# EAGLE schematic cos - POC (EAGLE 9.4.0)
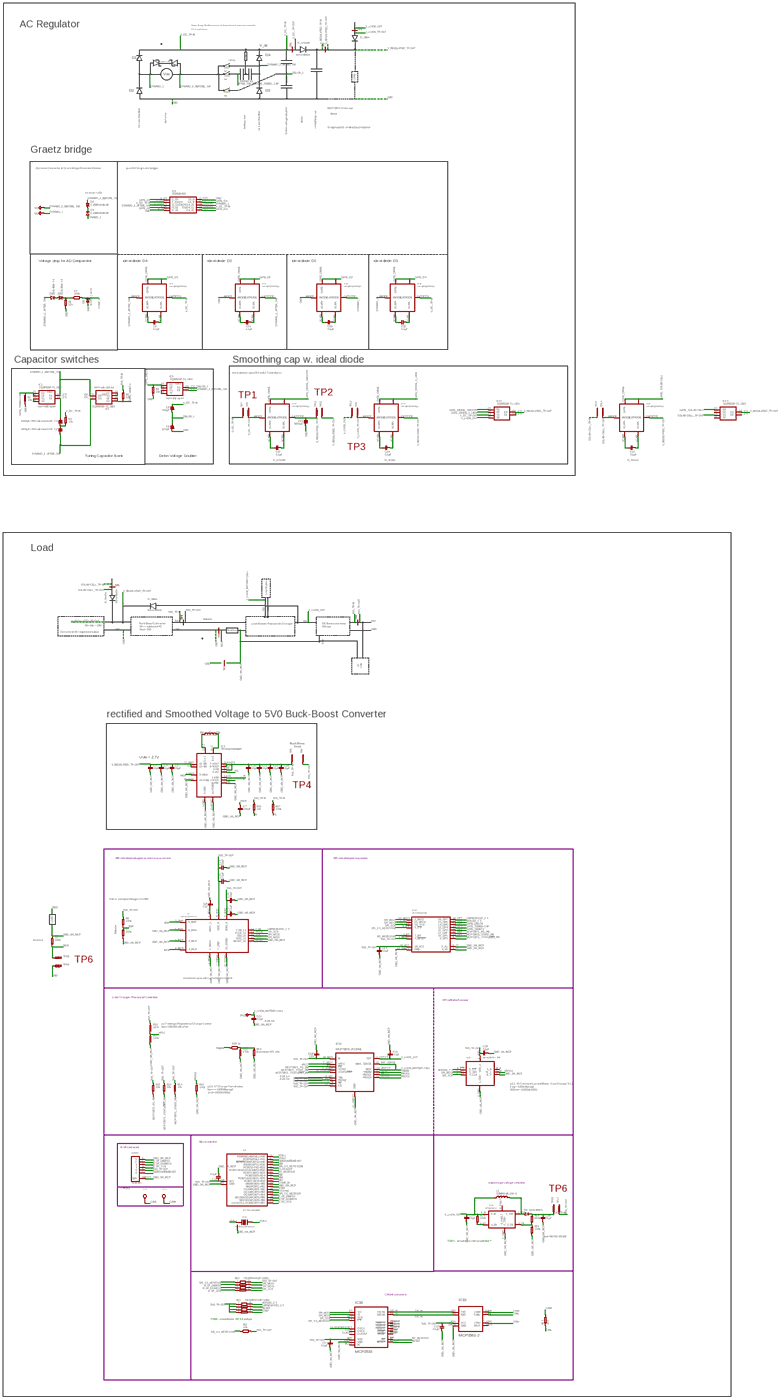
[diagram p0: schematic, sheet 1, overview]
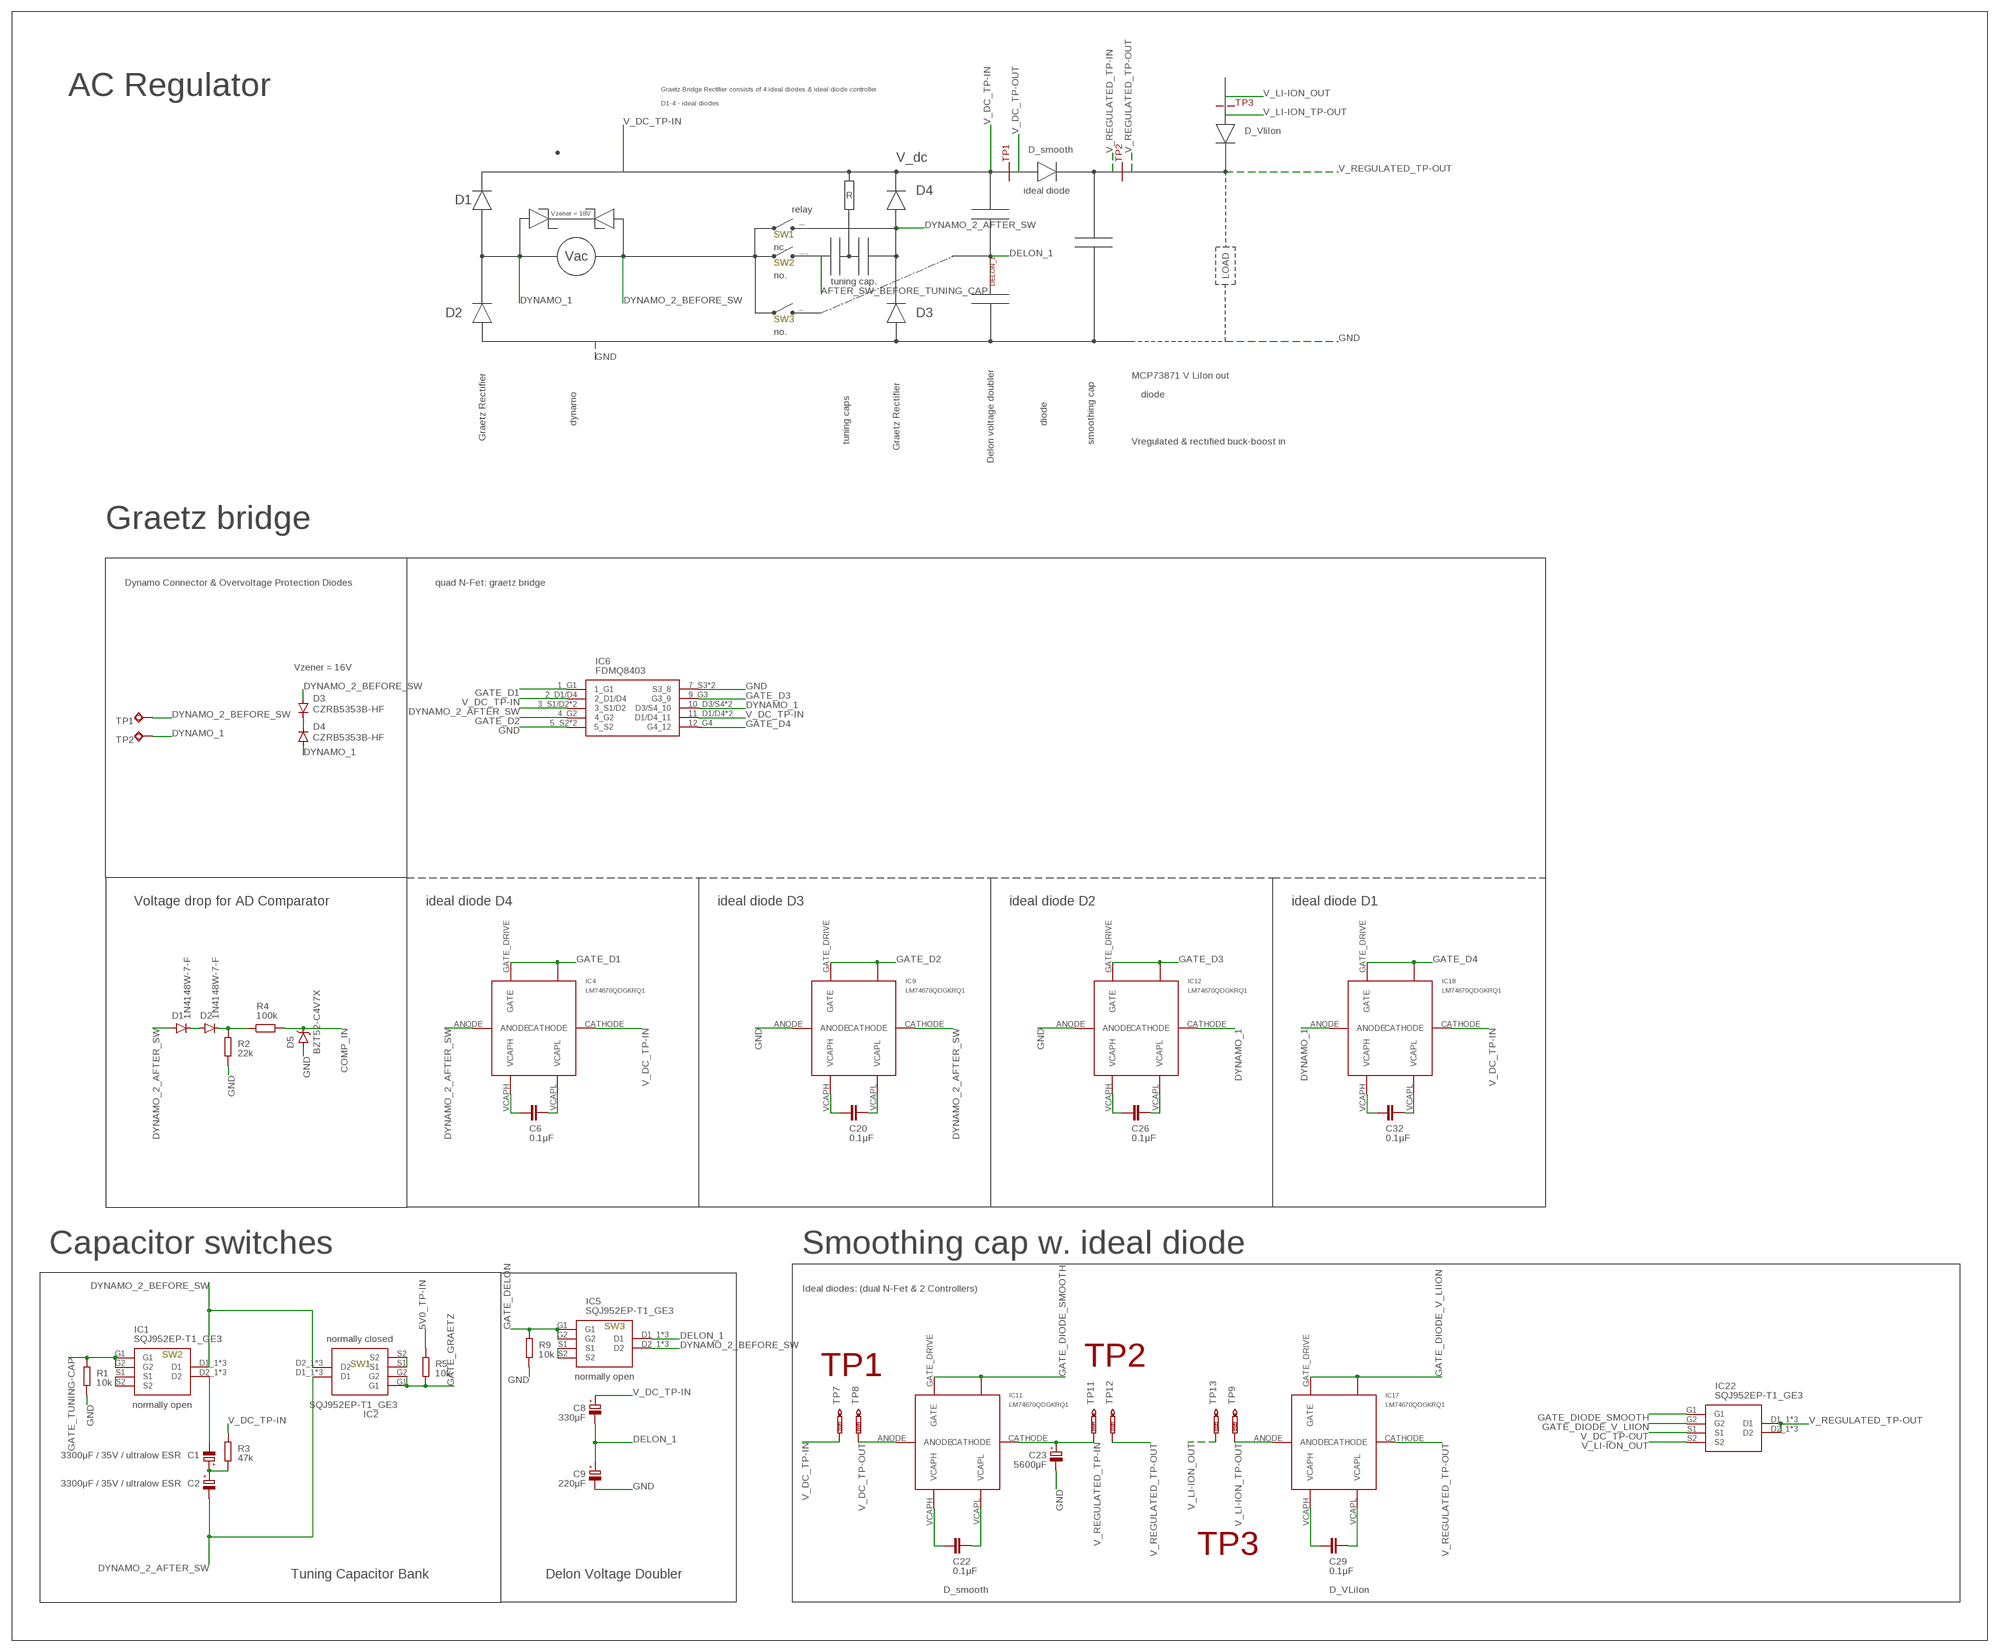
[diagram p1: schematic, sheet 1, part 1 of 5]
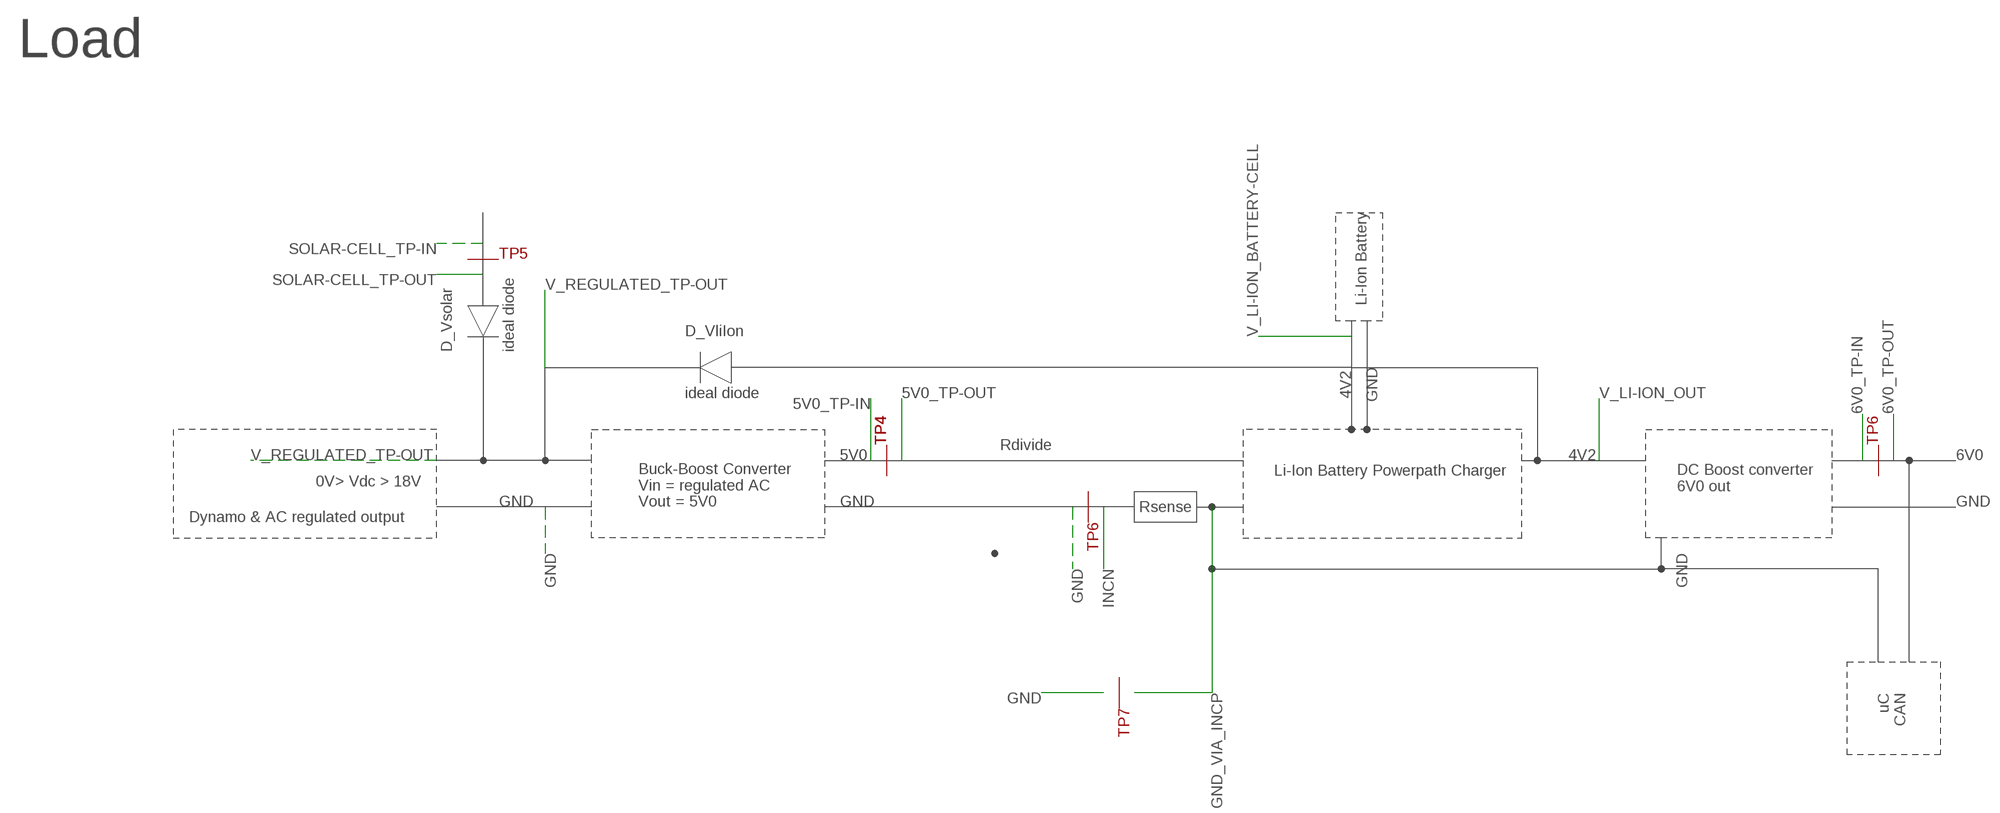
[diagram p2: schematic, sheet 1, part 2 of 5]
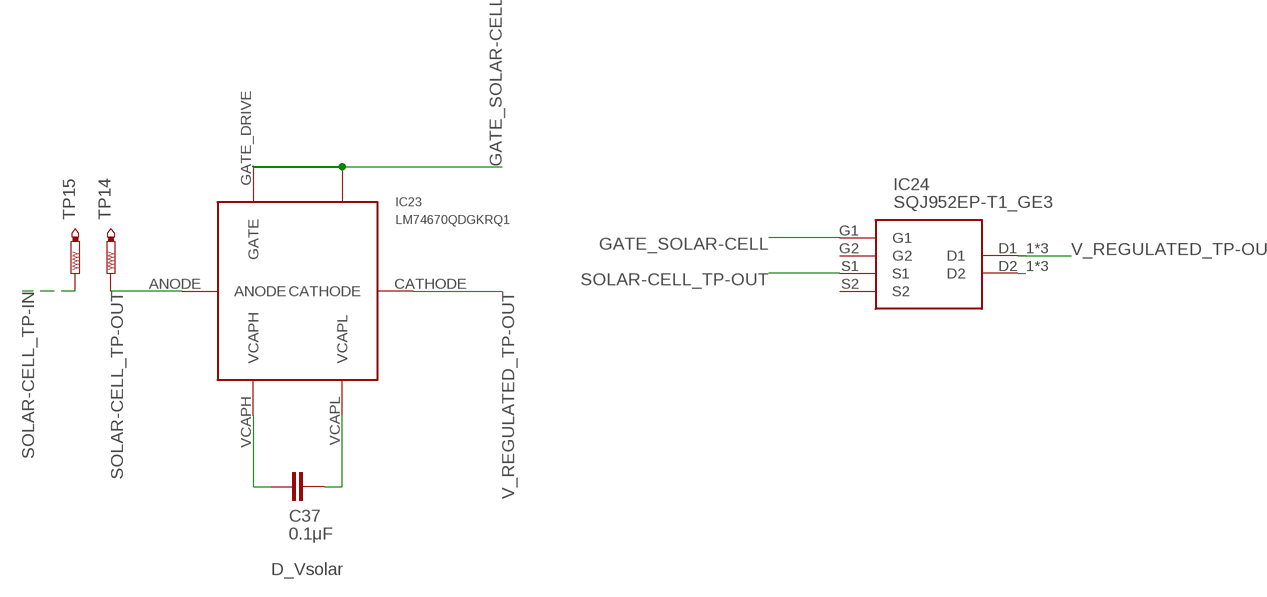
[diagram p3: schematic, sheet 1, part 3 of 5]
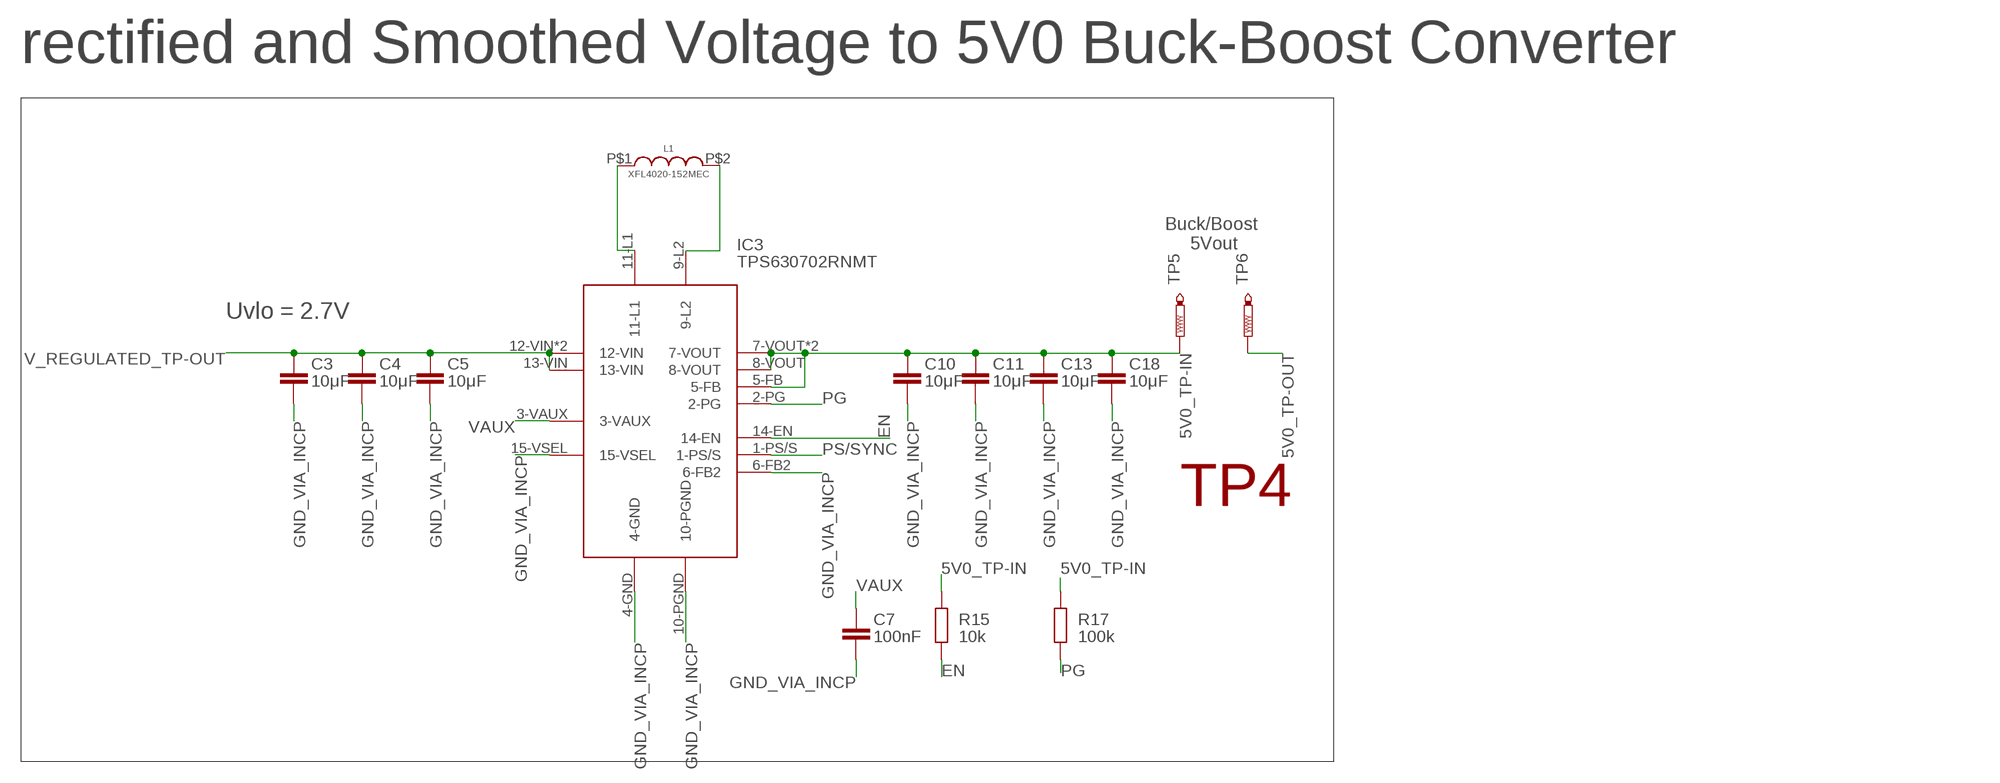
[diagram p4: schematic, sheet 1, part 4 of 5]
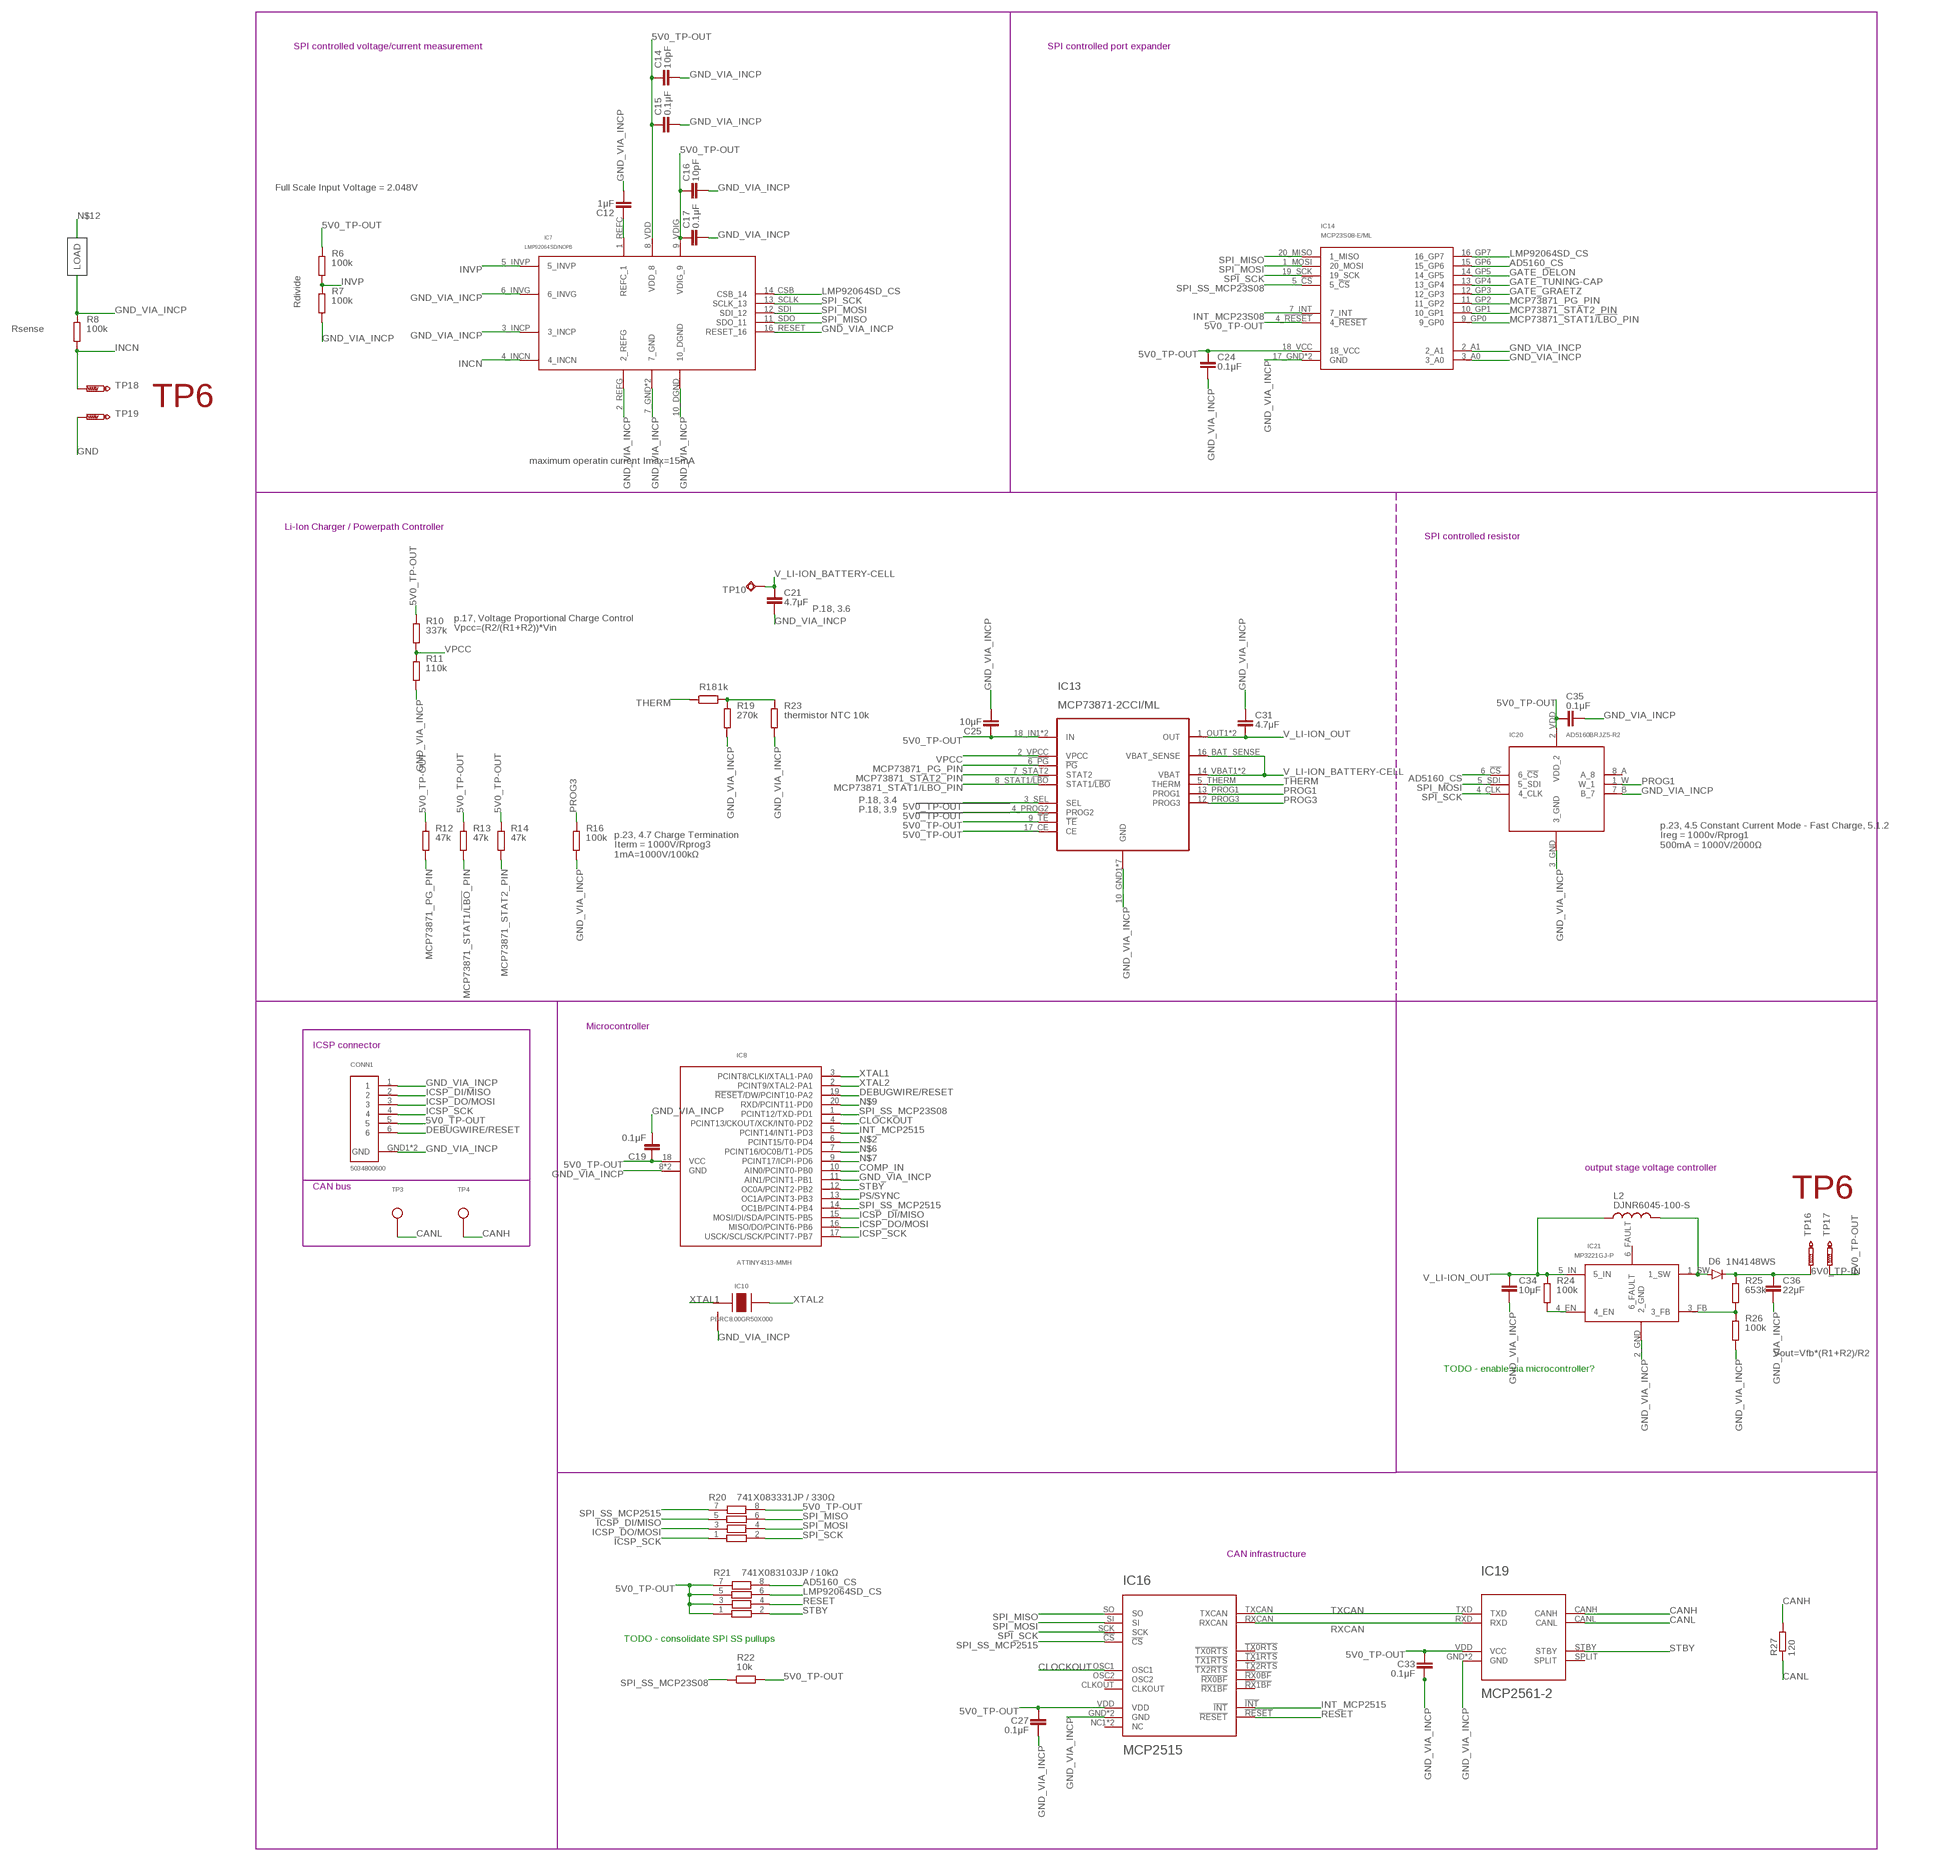
[diagram p5: schematic, sheet 1, part 5 of 5]

## Parts
C1  3300μF / 35V / ultralow ESR  CPOL-EUE1.8-4  [E1,8-4]
C2  3300μF / 35V / ultralow ESR  CPOL-EUE1.8-4  [E1,8-4]
C3  10μF  C-EUC0805  [C0805]
C4  10μF  C-EUC0805  [C0805]
C5  10μF  C-EUC0603  [C0603]
C6  0.1μF  C-EUC0402  [C0402]
C7  100nF  C-EUC0402  [C0402]
C8  330μF  CPOL-EUE1.8-4  [E1,8-4]
C9  220μF  CPOL-EUE1.8-4  [E1,8-4]
C10  10μF  C-EUC0603  [C0603]
C11  10μF  C-EUC0805  [C0805]
C12  1μF  C-EUC0402  [C0402]
C13  10μF  C-EUC0805  [C0805]
C14  10pF  C-EUC0402  [C0402]
C15  0.1μF  C-EUC0402  [C0402]
C16  10pF  C-EUC0402  [C0402]
C17  0.1μF  C-EUC0402  [C0402]
C18  10μF  C-EUC0805  [C0805]
C19  0.1μF  C-EUC0402  [C0402]
C20  0.1μF  C-EUC0402  [C0402]
C21  4.7μF  C-EUC0402  [C0402]
C22  0.1μF  C-EUC0402  [C0402]
C23  5600μF  CPOL-EUE1.8-4  [E1,8-4]
C24  0.1μF  C-EUC0402  [C0402]
C25  10μF  C-EUC0402  [C0402]
C26  0.1μF  C-EUC0402  [C0402]
C27  0.1μF  C-EUC0402  [C0402]
C29  0.1μF  C-EUC0402  [C0402]
C31  4.7μF  C-EUC0402  [C0402]
C32  0.1μF  C-EUC0402  [C0402]
C33  0.1μF  C-EUC0402  [C0402]
C34  10μF  C-EUC0402  [C0402]
C35  0.1μF  C-EUC0402  [C0402]
C36  22μF  C-EUC0402  [C0402]
C37  0.1μF  C-EUC0402  [C0402]
CONN1  5034800600  [SMT]
D1  1N4148W-7-F  CGRM4006-G  [SOD-123_MINI-SMA]
D2  1N4148W-7-F  CGRM4006-G  [SOD-123_MINI-SMA]
D3  CZRB5353B-HF  DIODE-DO214AA  [DO214AA]
D4  CZRB5353B-HF  DIODE-DO214AA  [DO214AA]
D5  BZT52-C4V7X  CESD5V0D1  [SOD-123]
D6  1N4148WS  [SOD-323]
IC1  SQJ952EP-T1_GE3  [SO-8L]
IC2  SQJ952EP-T1_GE3  [SO-8L]
IC3  TPS630702RNMT  TPS630701  [VQFN]
IC4  LM74670QDGKRQ1  LM74670  [VSSOP-8]
IC5  SQJ952EP-T1_GE3  [SO-8L]
IC6  FDMQ8403  [MLP-12]
IC7  LMP92064SD/NOPB  LMP92064SD  [WSON-16]
IC8  ATTINY4313-MMH  ATTINY4313VQFN-20  [VQFN-20]
IC9  LM74670QDGKRQ1  LM74670  [VSSOP-8]
IC10  PBRC8.00GR50X000  PRQV  [SMT]
IC11  LM74670QDGKRQ1  LM74670  [VSSOP-8]
IC12  LM74670QDGKRQ1  LM74670  [VSSOP-8]
IC13  MCP73871-2CCI/ML  MCP73871-2AAI/ML  [QFN50P400X400X100-21N]
IC14  MCP23S08-E/ML  MCP23S08  [QFN20]
IC16  MCP2515  MCP2515-I-ML  [QFN20]
IC17  LM74670QDGKRQ1  LM74670  [VSSOP-8]
IC18  LM74670QDGKRQ1  LM74670  [VSSOP-8]
IC19  MCP2561-2  [DFN10]
IC20  AD5160BRJZ5-R2  AD5160  [SOT-23-8]
IC21  MP3221GJ-P  MP3221  [TSOT23-6]
IC22  SQJ952EP-T1_GE3  [SO-8L]
IC23  LM74670QDGKRQ1  LM74670  [VSSOP-8]
IC24  SQJ952EP-T1_GE3  [SO-8L]
L1  XFL4020-152MEC  [SMD]
L2  DJNR6045-100-S  [DJNR6045-100-S]
R1  10k  R-EU_R0402  [R0402]
R2  22k  R-EU_R0402  [R0402]
R3  47k  R-EU_R0402  [R0402]
R4  100k  R-EU_R0402  [R0402]
R5  10k  R-EU_R0402  [R0402]
R6  100k  R-EU_R1206  [R1206]
R7  100k  R-EU_R1206  [R1206]
R8  100k  R-EU_R1206  [R1206]
R9  10k  R-EU_R0402  [R0402]
R10  337k  R-EU_R0402  [R0402]
R11  110k  R-EU_R0402  [R0402]
R12  47k  R-EU_R0402  [R0402]
R13  47k  R-EU_R0402  [R0402]
R14  47k  R-EU_R0402  [R0402]
R15  10k  R-EU_R0402  [R0402]
R16  100k  R-EU_R0402  [R0402]
R17  100k  R-EU_R0402  [R0402]
R18  1k  R-EU_R0402  [R0402]
R19  270k  R-EU_R0402  [R0402]
R20  741X083331JP / 330Ω  741X083331JP  [0402]
R21  741X083103JP / 10kΩ  741X083331JP  [0402]
R22  10k  R-EU_R0402  [R0402]
R23  thermistor NTC 10k  R-EU_V526-0  [V526-0]
R24  100k  R-EU_R0402  [R0402]
R25  653k  R-EU_R0402  [R0402]
R26  100k  R-EU_R0402  [R0402]
R27  120  R-EU_R0402  [R0402]
TP1  Li-Ion Cell +  TPSQPAD1-13  [P1-13]
TP2  Li-Ion Cell +  TPSQPAD1-13  [P1-13]
TP3  CAN Low  TP  [TH]
TP4  CAN High  TP  [TH]
TP5  PTR1TP10SQ  [TP10SQ]
TP6  PTR1TP10SQ  [TP10SQ]
TP7  PTR1TP10SQ  [TP10SQ]
TP8  PTR1TP10SQ  [TP10SQ]
TP9  PTR1TP10SQ  [TP10SQ]
TP10  Li-Ion Cell +  TPSQPAD1-13  [P1-13]
TP11  PTR1TP10SQ  [TP10SQ]
TP12  PTR1TP10SQ  [TP10SQ]
TP13  PTR1TP10SQ  [TP10SQ]
TP14  PTR1TP10SQ  [TP10SQ]
TP15  PTR1TP10SQ  [TP10SQ]
TP16  PTR1TP10SQ  [TP10SQ]
TP17  PTR1TP10SQ  [TP10SQ]
TP18  PTR1TP10SQ  [TP10SQ]
TP19  PTR1TP10SQ  [TP10SQ]

## Nets
5V0_TP-IN [5v0]: C10.1 C11.1 C13.1 C18.1 IC3.5-FB IC3.7-VOUT IC3.8-VOUT IC3.VOUT(7-VOUT) R5.2 R15.2 R17.2 TP5.TP
5V0_TP-OUT [5v0]: C14.1 C15.1 C16.1 C17.1 C19.1 C24.1 C25.1 C27.1 C33.1 C35.1 CONN1.5 IC7.8_VDD(VDD_8) IC7.9_VDIG(VDIG_9) IC8.18(VCC) IC13.3_SEL(SEL) IC13.4_PROG2(PROG2) IC13.9_!TE!(!TE!) IC13.17_CE(CE) IC13.18_IN1(IN) IC13.19_IN2(IN) IC14.4_!RESET! IC14.18_VCC IC16.VDD IC19.VDD(VCC) IC20.2_VDD(VDD_2) R6.2 R10.2 R12.2 R13.2 R14.2 R20.8 R21.1 R21.3 R21.5 R21.7 R22.2 TP6.TP
6V0_TP-IN: C36.1 D6.C R25.2 TP16.TP
6V0_TP-OUT: TP17.TP
AD5160_CS: IC14.15_GP6 IC20.6_!CS! R21.8
AFTER_SW_BEFORE_TUNING_CAP: C1.- IC1.D2_1(D2) IC1.D2_2(D2) IC1.D2_3(D2)
CANH [5v0]: IC19.CANH R27.2 TP4.TP$1
CANL [5v0]: IC19.CANL R27.1 TP3.TP$1
CLOCKOUT [signal]: IC8.4(PCINT13/CKOUT/XCK/INT0-PD2) IC16.OSC1
COMP_IN: D5.C IC8.10(AIN0/PCINT0-PB0) R4.2
D1_VCAPH: C6.2 IC4.VCAPH
D1_VCAPL: C6.1 IC4.VCAPL
D2_VCAPH: C20.2 IC9.VCAPH
D2_VCAPL: C20.1 IC9.VCAPL
D3_VCAPH: C26.2 IC12.VCAPH
D3_VCAPL: C26.1 IC12.VCAPL
D4_VCAPH: C32.2 IC18.VCAPH
D4_VCAPL: C32.1 IC18.VCAPL
D_SMOOTH_VCAP: C22.1 IC11.VCAPL
D_SMOOTH_VCAPH: C22.2 IC11.VCAPH
D_VLIION_VCAPH: C29.2 IC17.VCAPH
D_VLIION_VCAPH1: C37.2 IC23.VCAPH
D_VLIION_VCAPL: C29.1 IC17.VCAPL
D_VLIION_VCAPL1: C37.1 IC23.VCAPL
DEBUGWIRE/RESET [signal]: CONN1.6 IC8.19(!RESET!/DW/PCINT10-PA2)
DELON_1: C8.- C9.+ IC5.D1_1(D1) IC5.D1_2(D1) IC5.D1_3(D1)
DYNAMO_1 [dynamo_out]: D4.A IC6.10_D3/S4(D3/S4_10) IC6.D3/S4(D3/S4_10) IC12.CATHODE IC18.ANODE TP2.TP
DYNAMO_2_AFTER_SW: C2.- D1.A IC2.D1_1(D1) IC2.D1_2(D1) IC2.D1_3(D1) IC4.ANODE IC6.3_S1/D2 IC6.S1/D2(3_S1/D2) IC9.CATHODE
DYNAMO_2_BEFORE_SW: D3.A IC1.D1_1(D1) IC1.D1_2(D1) IC1.D1_3(D1) IC2.D2_1(D2) IC2.D2_2(D2) IC2.D2_3(D2) IC5.D2_1(D2) IC5.D2_2(D2) IC5.D2_3(D2) TP1.TP
EN: IC3.14-EN R15.1
EN2: IC21.4_EN R24.1
FB: IC21.3_FB R25.1 R26.2
GATE_D1: IC4.GATE_DRIVE(GATE) IC4.GATE_PULLD IC6.1_G1
GATE_D2: IC6.4_G2 IC9.GATE_DRIVE(GATE) IC9.GATE_PULLD
GATE_D3: IC6.9_G3(G3_9) IC12.GATE_DRIVE(GATE) IC12.GATE_PULLD
GATE_D4: IC6.12_G4(G4_12) IC18.GATE_DRIVE(GATE) IC18.GATE_PULLD
GATE_DELON: IC5.G1 IC5.G2 IC14.14_GP5 R9.2
GATE_DIODE_SMOOTH: IC11.GATE_DRIVE(GATE) IC11.GATE_PULLD IC22.G1
GATE_DIODE_V_LIION: IC17.GATE_DRIVE(GATE) IC17.GATE_PULLD IC22.G2
GATE_GRAETZ: IC2.G1 IC2.G2 IC14.12_GP3 R5.1
GATE_SOLAR-CELL: IC23.GATE_DRIVE(GATE) IC23.GATE_PULLD IC24.G1
GATE_TUNING-CAP: IC1.G1 IC1.G2 IC14.13_GP4 R1.2
GND: C9.- C23.- D5.A IC6.5_S2 IC6.6_S2(5_S2) IC6.7_S3(S3_8) IC6.8_S3(S3_8) IC9.ANODE IC12.ANODE R1.1 R2.1 R9.1 TP19.TP
GND_VIA_INCP: C3.2 C4.2 C5.2 C7.2 C10.2 C11.2 C12.2 C13.2 C14.2 C15.2 C16.2 C17.2 C18.2 C19.2 C21.2 C24.2 C25.2 C27.2 C31.1 C33.2 C34.2 C35.2 C36.2 CONN1.1 CONN1.GND1(GND) CONN1.GND2(GND) IC3.4-GND IC3.6-FB2 IC3.10-PGND IC3.15-VSEL IC7.2_REFG IC7.3_INCP IC7.6_INVG IC7.7_GND IC7.10_DGND IC7.16_RESET(RESET_16) IC7.GND1(7_GND) IC8.8(GND) IC8.11(AIN1/PCINT1-PB1) IC8.GND IC10.GND IC13.10_GND1(GND) IC13.11_GND2(GND) IC13.GND2(GND) IC13.GND3(GND) IC13.GND4(GND) IC13.GND5(GND) IC13.GND6(GND) IC14.2_A1 IC14.3_A0 IC14.17_GND(GND) IC14.GND IC16.GND IC16.GND6(GND) IC19.GND IC19.VSS(GND) IC20.3_GND IC20.7_B(B_7) IC21.2_GND R7.1 R8.2 R11.1 R16.1 R19.1 R23.1 R26.1
ICSP_DI/MISO [signal]: CONN1.2 IC8.15(MOSI/DI/SDA/PCINT5-PB5) R20.5
ICSP_DO/MOSI [signal]: CONN1.3 IC8.16(MISO/DO/PCINT6-PB6) R20.3
ICSP_SCK [signal]: CONN1.4 IC8.17(USCK/SCL/SCK/PCINT7-PB7) R20.1
INCN: IC7.4_INCN R8.1 TP18.TP
INT_MCP23S08: IC14.7_INT
INT_MCP2515 [signal]: IC8.5(PCINT14/INT1-PD3) IC16.!INT!
INVP: IC7.5_INVP R6.1 R7.2
LMP92064SD_CS: IC7.14_CSB(CSB_14) IC14.16_GP7 R21.6
MCP73871_PG_PIN [signal]: IC13.!6_PG!(!PG!) IC14.11_GP2 R12.1
MCP73871_STAT1/!LBO!_PIN [signal]: IC13.8_STAT1/!LBO!(STAT1/!LBO!) IC14.9_GP0 R13.1
MCP73871_STAT2_PIN [signal]: IC13.7_STAT2(STAT2) IC14.10_GP1 R14.1
N$1: IC3.11-L1 L1.P$1
N$2: IC8.6(PCINT15/T0-PD4)
N$3: D1.C D2.A
N$4: D2.C R2.2 R4.1
N$5: IC3.9-L2 L1.P$2
N$6: IC8.7(PCINT16/OC0B/T1-PD5)
N$7: IC8.9(PCINT17/ICPI-PD6)
N$8: R18.2 R19.2 R23.2
N$9: IC8.20(RXD/PCINT11-PD0)
N$13: IC1.S1 IC1.S2
N$16: IC2.S1 IC2.S2
N$17: C12.1 IC7.1_REFC(REFC_1)
N$20: IC5.S1 IC5.S2
PG [signal]: IC3.2-PG R17.1
PROG1 [signal]: IC13.13_PROG1(PROG1) IC20.1_W(W_1)
PROG3 [signal]: IC13.12_PROG3(PROG3) R16.2
PS/SYNC [signal]: IC3.1-PS/S IC8.13(OC1A/PCINT3-PB3)
RESET [signal]: IC16.!RESET! R21.4
RXCAN [signal]: IC16.RXCAN IC19.RXD
SOLAR-CELL_TP-IN: TP15.TP
SOLAR-CELL_TP-OUT: IC23.ANODE IC24.S1 TP14.TP
SPI_MISO [signal]: IC7.11_SDO(SDO_11) IC14.20_MISO(1_MISO) IC16.SO R20.6
SPI_MOSI [signal]: IC7.12_SDI(SDI_12) IC14.1_MOSI(20_MOSI) IC16.SI IC20.5_SDI R20.4
SPI_SCK: IC7.13_SCLK(SCLK_13) IC14.19_SCK IC16.SCK IC20.4_CLK R20.2
SPI_SS_MCP23S08: IC8.1(PCINT12/TXD-PD1) IC14.5_!CS! R22.1
SPI_SS_MCP2515 [signal]: IC8.14(OC1B/PCINT4-PB4) IC16.!CS! R20.7
STBY [signal]: IC8.12(OC0A/PCINT2-PB2) IC19.STBY R21.2
SW: D6.A IC21.1_SW L2.2
THERM: IC13.5_THERM(THERM) R18.1
TUNIN_CAP2_BIAS: C1.+ C2.+ R3.1
TXCAN [signal]: IC16.TXCAN IC19.TXD
V_DC_TP-IN: C8.+ IC4.CATHODE IC6.2_D1/D4 IC6.11_D1/D4(D1/D4_11) IC6.D1/D4(D1/D4_11) IC18.CATHODE R3.2 TP7.TP
V_DC_TP-OUT: IC11.ANODE IC22.S1 TP8.TP
V_LI-ION_BATTERY-CELL: C21.1 IC13.14_VBAT1(VBAT) IC13.15_VBAT2(VBAT) IC13.16_BAT_SENSE(VBAT_SENSE) TP10.TP
V_LI-ION_OUT: C31.2 C34.1 IC13.1_OUT1(OUT) IC13.20_OUT2(OUT) IC21.5_IN IC22.S2 L2.1 R24.2 TP13.TP
V_LI-ION_TP-OUT: IC17.ANODE TP9.TP
V_REGULATED_TP-IN [5v0]: C23.+ IC11.CATHODE TP11.TP
V_REGULATED_TP-OUT [5v0]: C3.1 C4.1 C5.1 IC3.12-VIN IC3.13-VIN IC3.VIN(12-VIN) IC17.CATHODE IC22.D1_1(D1) IC22.D1_2(D1) IC22.D1_3(D1) IC22.D2_1(D2) IC22.D2_2(D2) IC22.D2_3(D2) IC23.CATHODE IC24.D1_1(D1) IC24.D1_2(D1) IC24.D1_3(D1) TP12.TP
VAUX: C7.1 IC3.3-VAUX
VPCC: IC13.2_VPCC(VPCC) R10.1 R11.2
XTAL1 [signal]: IC8.3(PCINT8/CLKI/XTAL1-PA0) IC10.XTAL1
XTAL2 [signal]: IC8.2(PCINT9/XTAL2-PA1) IC10.XTAL2
ZENER_COMMON: D3.C D4.C
Unconnected: IC16.!RX0BF! IC16.!RX1BF! IC16.!TX0RTS! IC16.!TX1RTS! IC16.!TX2RTS! IC16.CLKOUT IC16.NC1(NC) IC16.NC2(NC) IC16.OSC2 IC19.SPLIT IC20.8_A(A_8) IC21.6_FAULT IC24.D2_1(D2) IC24.D2_2(D2) IC24.D2_3(D2) IC24.G2 IC24.S2

## Notes on the sheet
- Graetz Bridge Rectifier consists of 4 ideal diodes & ideal diode controller
  
  D1-4 - ideal diodes
- AC Regulator
- TP3
- D_VliIon
- D_smooth
- V_dc | TP1 | TP2
- D4 | ideal diode
- R
- D1
- relay
- Vzener = 18V
- graetz
- SW1
- nc.
- tuning cap
- Vac | DELON_1
- SW2 | LOAD
- no.
- tuning cap.
- delon
- D2 | D3
- SW3
- no.
- MCP73871 V LiIon out
- diode
- Graetz Rectifier
- Graetz Rectifier | Delon voltage doubler
- dynamo | diode
- tuning caps | smoothing cap | Vregulated & rectified buck-boost in
- Graetz bridge
- Dynamo Connector & Overvoltage Protection Diodes | quad N-Fet: graetz bridge
- Vzener = 16V
- Voltage drop for AD Comparator | ideal diode D4 | ideal diode D3 | ideal diode D2 | ideal diode D1
- Capacitor switches | Smoothing cap w. ideal diode
- Ideal diodes: (dual N-Fet & 2 Controllers)
- SW3
- normally closed
- SW2
- SW1 | TP2
- normally open | TP1
- normally open
- TP3
- Tuning Capacitor Bank | Delon Voltage Doubler
- D_smooth | D_VLiIon | D_Vsolar
- Load
- TODO: shunt?
- TP5
- Li-Ion Battery
- D_VliIon
- D_Vsolar | ideal diode
- GND
- ideal diode | 4V2
- TP4 | TP4 | Rdivide | TP6
- 5V0 | 4V2 | 6V0
- 0V> Vdc > 18V | Li-Ion Battery Powerpath Charger
- DC Boost converter
  6V0 out
- GND
- Buck-Boost Converter
  Vin = regulated AC
  Vout = 5V0
- GND | Rsense | GND
- Dynamo & AC regulated output | TP6
- GND
- uC
  CAN
- TP7
- rectified and Smoothed Voltage to 5V0 Buck-Boost Converter
- Buck/Boost 
  5Vout
- Uvlo = 2.7V
- TP4
- SPI controlled voltage/current measurement | SPI controlled port expander
- Full Scale Input Voltage = 2.048V
- LOAD
- Rdivide
- Rsense
- TP6
- maximum operatin current Imax=15mA
- Li-Ion Charger / Powerpath Controller
- SPI controlled resistor
- P.18, 3.6
- p.17, Voltage Proportional Charge Control
  Vpcc=(R2/(R1+R2))*Vin
- P.18, 3.4
- P.18, 3.9
- p.23, 4.5 Constant Current Mode - Fast Charge, 5.1.2
  Ireg = 1000v/Rprog1
  500mA = 1000V/2000Ω
- p.23, 4.7 Charge Termination
  Iterm = 1000V/Rprog3
  1mA=1000V/100kΩ
- Microcontroller
- ICSP connector
- output stage voltage controller
- CAN bus
- TP6
- Vout=Vfb*(R1+R2)/R2
- TODO - enable via microcontroller?
- CAN infrastructure
- TODO - consolidate SPI SS pullups

## Library data of the parts
C1 C2 C8 C9 C23 = rcl:CPOL-EU: POLARIZED CAPACITOR, European symbol; SPICEPREFIX: C
C3-C7 C10-C22 C24-C27 C29 C31-C37 = rcl:C-EU: CAPACITOR, European symbol; SPICEPREFIX: C
CONN1 = 5034800600 FPC Connector:5034800600
D1 D2 = diode:CGRM400*-G: Molded plasitc,JEDEC SOD-123/Mini SMA Source: Comchip CGRM4001-G.pdf
D3 D4 = diode:DIODE-: DIODE
D5 = Diodes:CESD5V0D1: SOD-123 Plastic-Encapsulate Diodes Uni-direction ESD Protection Diode Manufacturer's datasheet <https://seeeddoc.github.io/Open_parts_library/res/304060001.pdf>; CREATED_BY: PCBLayout.com; MANUFACTURER: JCET; MPN: CESD5V0D1; PACKAGE: SOD-123
D6 = Diodes:1N4148WS: DIODE GEN PURP 75V 150MA SOD323F Manufacturer's datasheet <https://www.onsemi.com/pub/Collateral/1N914BWS-D.pdf>; CREATED_BY: PCBLayout.com; DIGIKEY_PART_NUMBER: 1N4148WSFSTR-ND; MANUFACTURER: Diodes Incorporated; MPN: 1N4148WS; PACKAGE: SOD-323
IC1 IC2 IC5 IC22 IC24 = SQJ952EP-T1_GE3 - Dual N-Fet:SQJ952EP-T1_GE3
IC3 = TPS630701 - Buck Boost 5V regulator:TPS630701
IC4 IC9 IC11 IC12 IC17 IC18 IC23 = LM74670 - Smart Diode Rectifier Controller:LM74670
IC6 = FDMQ8403 4x N-Channel Fet:FDMQ8403
IC7 = LMP92064SD - LMP92064 Precision Low-Side, 125-kSps Simultaneous Sampling Current Sensor and Voltage Monitor With SPI:LMP92064SD
IC8 = ATtiny4313 microcontroller:ATTINY4313; SPICEPREFIX: X
IC10 = PRQV8.00CR1510Y00L - 8MHz resonator:PRQV
IC13 = MCP73871 - Powerpath and Charge Controller:MCP73871-2AAI/ML: IC, BATTERY CHARGER, 1A; MPN: MCP73871-2AAI/ML; OC_FARNELL: 1642487; OC_NEWARK: 54M4955; PACKAGE: QFN-20; SUPPLIER: Microchip
IC14 = MCP23S08 - 8-Bit IO Expander with Serial Interface:MCP23S08
IC16 = MCP2515-I-ML - Standalonce CAN Controller with SPI Interface:MCP2515-I-ML
IC19 = MCP2561-2 - High-Speed CAN Transceiver:MCP2561-2
IC20 = ad5160 - 256-Position SPI-Compatible Digital Potentiometer:AD5160
IC21 = MP3221–2.7A, 1.2MHZ, HIGH-EFFICIENCY STEP UP CONVERTER WITH INPUT DISCONNECT:MP3221
L1 = XFL4020-152MEC Inductor 1.5uH:XFL4020-152MEC
L2 = DJNR6045-100S Power Inductor:DJNR6045-100-S: Shielded Power Inductors Package 6.6 × 6.6 mm x 4.1 mm high Source: http://www.farnell.com/datasheets/1681958.pdf
R1-R19 R22-R27 = rcl:R-EU_: RESISTOR, European symbol; SPICEPREFIX: R
R20 R21 = 741X083331JP Resistor Array:741X083331JP
TP1 TP2 TP10 = testpad:TPSQ: Test pad
TP3 TP4 = signal testpoint:TP
TP5-TP9 TP11-TP19 = testpad:PTR1: TEST PIN

## Net classes
0 GND: width 0.254 mm, drill 0.254 mm, clearance 0.127 mm
1 Bat+: width 0.5 mm, drill 0.3 mm, clearance 0.2 mm
2 5v0: width 0.3 mm, drill 0.3 mm, clearance 0.2 mm
3 signal: width 0.25 mm, drill 0.3 mm, clearance 0.2 mm
4 6V0: width 0.3 mm, drill 0.3 mm, clearance 0.2 mm
5 dynamo_out: width 0.4 mm, drill 0.3 mm, clearance 0.2 mm